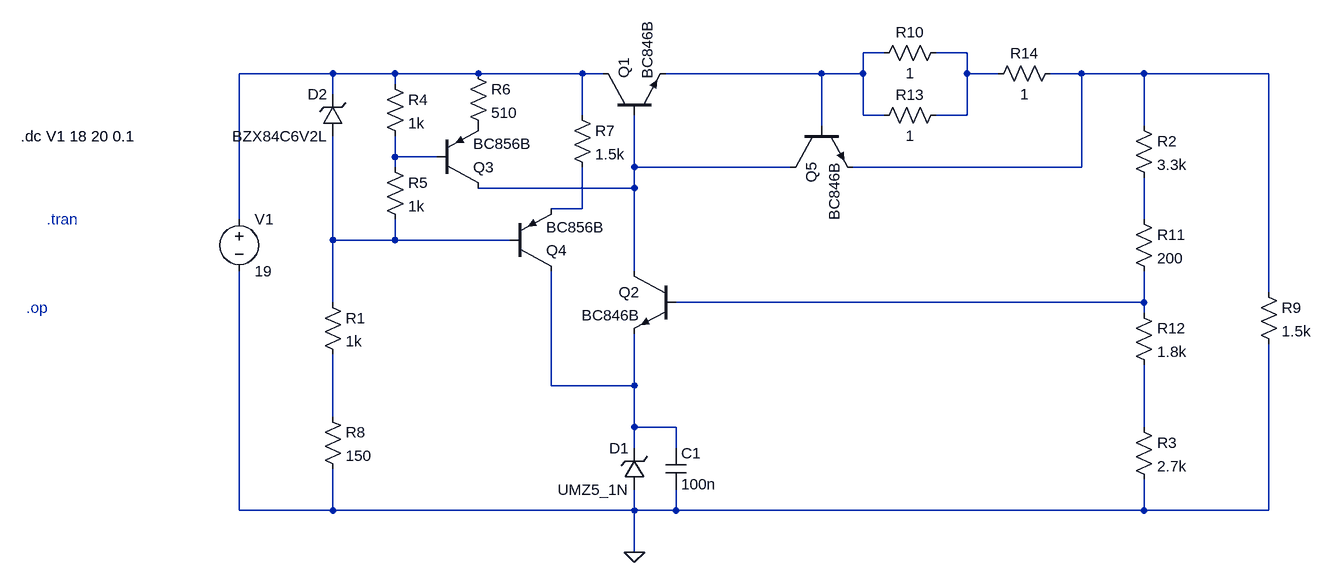
[diagram p0: schematic Proiect Stabilizator Tensiune Schema LTSpice.asc]
Proiect Stabilizator Tensiune Schema LTSpice.asc, the LTspice schematic file:
Version 4
SHEET 1 1684 680
WIRE 960 -128 928 -128
WIRE 1088 -128 1040 -128
WIRE 112 -96 -32 -96
WIRE 208 -96 112 -96
WIRE 336 -96 208 -96
WIRE 496 -96 336 -96
WIRE 528 -96 496 -96
WIRE 864 -96 624 -96
WIRE 928 -96 928 -128
WIRE 928 -96 864 -96
WIRE 1088 -96 1088 -128
WIRE 1136 -96 1088 -96
WIRE 1264 -96 1216 -96
WIRE 1360 -96 1264 -96
WIRE 1552 -96 1360 -96
WIRE 208 -80 208 -96
WIRE 112 -64 112 -96
WIRE 496 -32 496 -96
WIRE 928 -32 928 -96
WIRE 960 -32 928 -32
WIRE 1088 -32 1088 -96
WIRE 1088 -32 1040 -32
WIRE 864 -16 864 -96
WIRE 1360 -16 1360 -96
WIRE 208 32 208 0
WIRE 272 32 208 32
WIRE 208 48 208 32
WIRE 576 48 576 -32
WIRE 816 48 576 48
WIRE 1264 48 1264 -96
WIRE 1264 48 912 48
WIRE 576 80 576 48
WIRE 576 80 336 80
WIRE 496 112 496 48
WIRE 496 112 448 112
WIRE -32 128 -32 -96
WIRE 1360 128 1360 64
WIRE 112 160 112 0
WIRE 208 160 208 128
WIRE 208 160 112 160
WIRE 384 160 208 160
WIRE 576 208 576 80
WIRE 1552 240 1552 -96
WIRE 112 256 112 160
WIRE 1360 256 1360 208
WIRE 1360 256 640 256
WIRE 1360 272 1360 256
WIRE 448 384 448 208
WIRE 576 384 576 304
WIRE 576 384 448 384
WIRE 112 432 112 336
WIRE 576 448 576 384
WIRE 640 448 576 448
WIRE 1360 448 1360 352
WIRE 576 480 576 448
WIRE 640 480 640 448
WIRE -32 576 -32 208
WIRE 112 576 112 512
WIRE 112 576 -32 576
WIRE 576 576 576 544
WIRE 576 576 112 576
WIRE 640 576 640 544
WIRE 640 576 576 576
WIRE 1360 576 1360 528
WIRE 1360 576 640 576
WIRE 1552 576 1552 320
WIRE 1552 576 1360 576
WIRE 576 640 576 576
FLAG 576 640 0
SYMBOL voltage -32 112 R0
WINDOW 123 0 0 Left 0
WINDOW 39 0 0 Left 0
SYMATTR InstName V1
SYMATTR Value 19
SYMBOL npn 528 -32 R270
SYMATTR InstName Q1
SYMATTR Value BC846B
SYMBOL npn 640 208 M0
SYMATTR InstName Q2
SYMATTR Value BC846B
SYMBOL zener 592 544 R180
WINDOW 0 24 64 Left 2
WINDOW 3 24 0 Left 2
SYMATTR InstName D1
SYMATTR Value UMZ5_1N
SYMATTR Description Diode
SYMATTR Type diode
SYMBOL res 1344 -32 R0
SYMATTR InstName R2
SYMATTR Value 3.3k
SYMBOL res 1344 432 R0
SYMATTR InstName R3
SYMATTR Value 2.7k
SYMBOL res 96 240 R0
SYMATTR InstName R1
SYMATTR Value 1k
SYMBOL zener 128 0 R180
WINDOW 0 24 64 Left 2
WINDOW 3 24 0 Left 2
SYMATTR InstName D2
SYMATTR Value BZX84C6V2L
SYMATTR Description Diode
SYMATTR Type diode
SYMBOL res 192 -96 R0
SYMATTR InstName R4
SYMATTR Value 1k
SYMBOL res 192 32 R0
SYMATTR InstName R5
SYMATTR Value 1k
SYMBOL pnp 272 80 M180
SYMATTR InstName Q3
SYMATTR Value BC856B
SYMBOL res 320 -112 R0
SYMATTR InstName R6
SYMATTR Value 510
SYMBOL pnp 384 208 M180
SYMATTR InstName Q4
SYMATTR Value BC856B
SYMBOL res 480 -48 R0
SYMATTR InstName R7
SYMATTR Value 1.5k
SYMBOL res 96 416 R0
SYMATTR InstName R8
SYMATTR Value 150
SYMBOL res 1344 112 R0
SYMATTR InstName R11
SYMATTR Value 200
SYMBOL res 1344 256 R0
SYMATTR InstName R12
SYMATTR Value 1.8k
SYMBOL npn 816 -16 M90
SYMATTR InstName Q5
SYMATTR Value BC846B
SYMBOL cap 624 480 R0
SYMATTR InstName C1
SYMATTR Value 100n
SYMBOL res 1536 224 R0
SYMATTR InstName R9
SYMATTR Value 1.5k
SYMBOL res 1056 -144 R90
WINDOW 0 0 56 VBottom 2
WINDOW 3 32 56 VTop 2
SYMATTR InstName R10
SYMATTR Value 1
SYMBOL res 1056 -48 R90
WINDOW 0 0 56 VBottom 2
WINDOW 3 32 56 VTop 2
SYMATTR InstName R13
SYMATTR Value 1
SYMBOL res 1232 -112 R90
WINDOW 0 0 56 VBottom 2
WINDOW 3 32 56 VTop 2
SYMATTR InstName R14
SYMATTR Value 1
TEXT -368 0 Left 2 !.dc V1 18 20 0.1
TEXT -328 128 Left 2 ;.tran
TEXT -360 264 Left 2 ;.op

The netlist it stands for:
* Proiect Stabilizator Tensiune Schema LTSpice.asc
V1 N003 0 19
Q1 N003 N006 N001 0 BC846B
Q2 N006 N010 N011 0 BC846B
D1 0 N011 UMZ5_1N
R2 N004 N008 3.3k
R3 N013 0 2.7k
R1 N009 N012 1k
D2 N009 N003 BZX84C6V2L
R4 N003 N005 1k
R5 N005 N009 1k
Q3 N006 N005 P001 0 BC856B
R6 N003 P001 510
Q4 N011 N009 N007 0 BC856B
R7 N003 N007 1.5k
R8 N012 0 150
R11 N008 N010 200
R12 N010 N013 1.8k
Q5 N006 N001 N004 0 BC846B
C1 N011 0 100n
R9 N004 0 1.5k
R10 N002 N001 1
R13 N002 N001 1
R14 N004 N002 1
.model D D
.lib standard.dio
.model NPN NPN
.model PNP PNP
.lib standard.bjt
.dc V1 18 20 0.1
* .tran
* .op
.backanno
.end